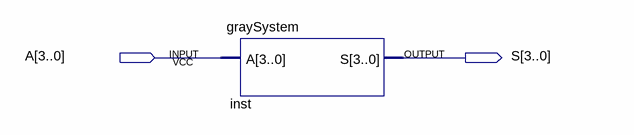
[diagram p0: schematic sheet]
// Quartus schematic Sistema.bdf as structural Verilog: 1 symbols, 2 pins
module Sistema (
  input  [3:0] A,
  output [3:0] S
);

  graySystem inst (.A(A), .S(S));
endmodule
